# Altium schematic sheet MPPT-BCR.SchDoc
size C
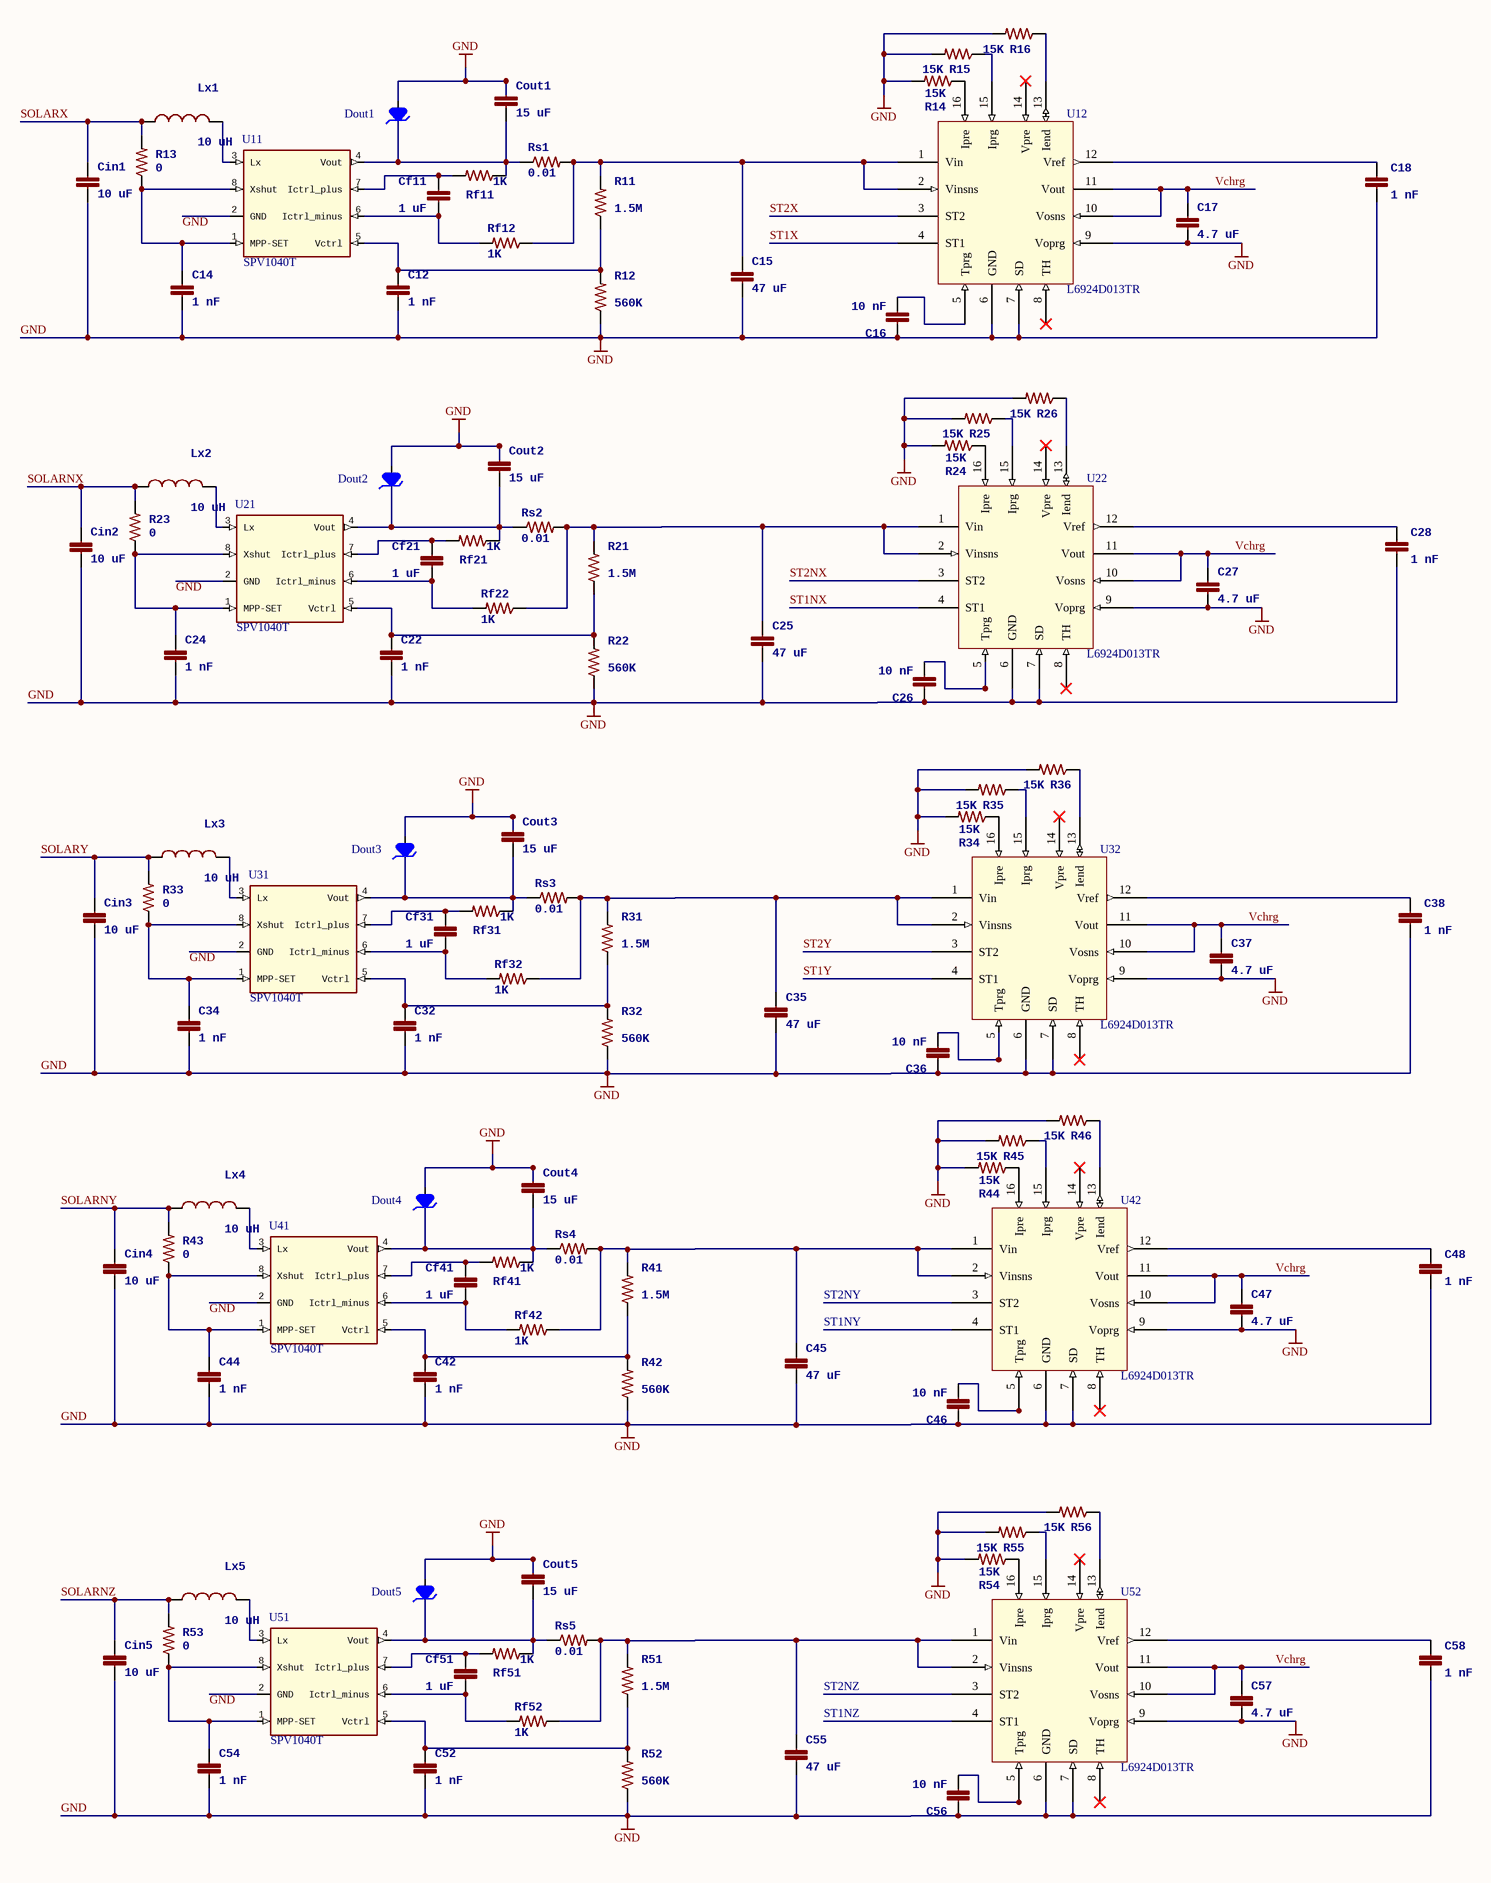
[diagram p0: MPPT-BCR.SchDoc]

## Parts
C12  1 nF  [0805]
C14  1 nF  [0805]
C15  47 uF  [0805]
C16  10 nF  [0805]
C17  4.7 uF  [0805]
C18  1 nF  [0805]
C22  1 nF  [0805]
C24  1 nF  [0805]
C25  47 uF  [0805]
C26  10 nF  [0805]
C27  4.7 uF  [0805]
C28  1 nF  [0805]
C32  1 nF  [0805]
C34  1 nF  [0805]
C35  47 uF  [0805]
C36  10 nF  [0805]
C37  4.7 uF  [0805]
C38  1 nF  [0805]
C42  1 nF  [0805]
C44  1 nF  [0805]
C45  47 uF  [0805]
C46  10 nF  [0805]
C47  4.7 uF  [0805]
C48  1 nF  [0805]
C52  1 nF  [0805]
C54  1 nF  [0805]
C55  47 uF  [0805]
C56  10 nF  [0805]
C57  4.7 uF  [0805]
C58  1 nF  [0805]
Cf11  1 uF  [0805]
Cf21  1 uF  [0805]
Cf31  1 uF  [0805]
Cf41  1 uF  [0805]
Cf51  1 uF  [0805]
Cin1  10 uF  [0805]
Cin2  10 uF  [0805]
Cin3  10 uF  [0805]
Cin4  10 uF  [0805]
Cin5  10 uF  [0805]
Cout1  15 uF  [1210]
Cout2  15 uF  [1210]
Cout3  15 uF  [1210]
Cout4  15 uF  [1210]
Cout5  15 uF  [1210]
Dout1  Diode_Zener  [STmite]  (value not drawn)
Dout2  Diode_Zener  [STmite]  (value not drawn)
Dout3  Diode_Zener  [STmite]  (value not drawn)
Dout4  Diode_Zener  [STmite]  (value not drawn)
Dout5  Diode_Zener  [STmite]  (value not drawn)
Lx1  10 uH  [1007]
Lx2  10 uH  [1007]
Lx3  10 uH  [1007]
Lx4  10 uH  [1007]
Lx5  10 uH  [1007]
R11  1.5M  [0805]
R12  560K  [0805]
R13  0  [0805]
R14  15K  [0805]
R15  15K  [0805]
R16  15K  [0805]
R21  1.5M  [0805]
R22  560K  [0805]
R23  0  [0805]
R24  15K  [0805]
R25  15K  [0805]
R26  15K  [0805]
R31  1.5M  [0805]
R32  560K  [0805]
R33  0  [0805]
R34  15K  [0805]
R35  15K  [0805]
R36  15K  [0805]
R41  1.5M  [0805]
R42  560K  [0805]
R43  0  [0805]
R44  15K  [0805]
R45  15K  [0805]
R46  15K  [0805]
R51  1.5M  [0805]
R52  560K  [0805]
R53  0  [0805]
R54  15K  [0805]
R55  15K  [0805]
R56  15K  [0805]
Rf11  1K  [0805]
Rf12  1K  [0805]
Rf21  1K  [0805]
Rf22  1K  [0805]
Rf31  1K  [0805]
Rf32  1K  [0805]
Rf41  1K  [0805]
Rf42  1K  [0805]
Rf51  1K  [0805]
Rf52  1K  [0805]
Rs1  0.01  [0805]
Rs2  0.01  [0805]
Rs3  0.01  [0805]
Rs4  0.01  [0805]
Rs5  0.01  [0805]
U11  Manufacturer Part Number: SPV1040T  [TSSOP8]  (hidden comment: SPV1040)
U12  L6924D013TR  [VQFN16_AP]
U21  Manufacturer Part Number: SPV1040T  [TSSOP8]  (hidden comment: SPV1040)
U22  L6924D013TR  [VQFN16_AP]
U31  Manufacturer Part Number: SPV1040T  [TSSOP8]  (hidden comment: SPV1040)
U32  L6924D013TR  [VQFN16_AP]
U41  Manufacturer Part Number: SPV1040T  [TSSOP8]  (hidden comment: SPV1040)
U42  L6924D013TR  [VQFN16_AP]
U51  Manufacturer Part Number: SPV1040T  [TSSOP8]  (hidden comment: SPV1040)
U52  L6924D013TR  [VQFN16_AP]

## Nets
GND: C12.2 C14.2 C15.2 C16.1 C17.2 C18.2 C22.2 C24.2 C25.2 C26.1 C27.2 C28.2 C32.2 C34.2 C35.2 C36.1 C37.2 C38.2 C42.2 C44.2 C45.2 C46.1 C47.2 C48.2 C52.2 C54.2 C55.2 C56.1 C57.2 C58.2 Cin1.2 Cin2.2 Cin3.2 Cin4.2 Cin5.2 Cout1.1 Cout2.1 Cout3.1 Cout4.1 Cout5.1 Dout1.2 Dout2.2 Dout3.2 Dout4.2 Dout5.2 R12.1 R14.2 R15.2 R16.2 R22.1 R24.2 R25.2 R26.2 R32.1 R34.2 R35.2 R36.2 R42.1 R44.2 R45.2 R46.2 R52.1 R54.2 R55.2 R56.2 U12.6(GND) U12.7(SD) U12.9(Voprg) U22.6(GND) U22.7(SD) U22.9(Voprg) U32.6(GND) U32.7(SD) U32.9(Voprg) U42.6(GND) U42.7(SD) U42.9(Voprg) U52.6(GND) U52.7(SD) U52.9(Voprg)
SOLARNX: Cin2.1 Lx2.1 R23.2
SOLARNY: Cin4.1 Lx4.1 R43.2
SOLARNZ: Cin5.1 Lx5.1 R53.2
SOLARX: Cin1.1 Lx1.1 R13.2
SOLARY: Cin3.1 Lx3.1 R33.2
ST1NX: U22.4(ST1)
ST1X: U12.4(ST1)
ST1Y: U32.4(ST1)
ST2NX: U22.3(ST2)
ST2X: U12.3(ST2)
ST2Y: U32.3(ST2)
Vchrg: C17.1 C27.1 C37.1 C47.1 C57.1 U12.10(Vosns) U12.11(Vout) U22.10(Vosns) U22.11(Vout) U32.10(Vosns) U32.11(Vout) U42.10(Vosns) U42.11(Vout) U52.10(Vosns) U52.11(Vout)
NetC12_1: C12.1 R11.1 R12.2 U11.5(Vctrl)
NetC14_1: C14.1 R13.1 U11.1(MPP-SET) U11.8(Xshut)
NetC15_1: C15.1 R11.2 Rf12.1 Rs1.2 U12.1(Vin) U12.2(Vinsns)
NetC16_2: C16.2 U12.5(Tprg)
NetC18_1: C18.1 U12.12(Vref)
NetC22_1: C22.1 R21.1 R22.2 U21.5(Vctrl)
NetC24_1: C24.1 R23.1 U21.1(MPP-SET) U21.8(Xshut)
NetC25_1: C25.1 R21.2 Rf22.1 Rs2.2 U22.1(Vin) U22.2(Vinsns)
NetC26_2: C26.2 U22.5(Tprg)
NetC28_1: C28.1 U22.12(Vref)
NetC32_1: C32.1 R31.1 R32.2 U31.5(Vctrl)
NetC34_1: C34.1 R33.1 U31.1(MPP-SET) U31.8(Xshut)
NetC35_1: C35.1 R31.2 Rf32.1 Rs3.2 U32.1(Vin) U32.2(Vinsns)
NetC36_2: C36.2 U32.5(Tprg)
NetC38_1: C38.1 U32.12(Vref)
NetC42_1: C42.1 R41.1 R42.2 U41.5(Vctrl)
NetC44_1: C44.1 R43.1 U41.1(MPP-SET) U41.8(Xshut)
NetC45_1: C45.1 R41.2 Rf42.1 Rs4.2 U42.1(Vin) U42.2(Vinsns)
NetC46_2: C46.2 U42.5(Tprg)
NetC48_1: C48.1 U42.12(Vref)
NetC52_1: C52.1 R51.1 R52.2 U51.5(Vctrl)
NetC54_1: C54.1 R53.1 U51.1(MPP-SET) U51.8(Xshut)
NetC55_1: C55.1 R51.2 Rf52.1 Rs5.2 U52.1(Vin) U52.2(Vinsns)
NetC56_2: C56.2 U52.5(Tprg)
NetC58_1: C58.1 U52.12(Vref)
NetCf11_1: Cf11.1 Rf11.2 U11.7(Ictrl_plus)
NetCf11_2: Cf11.2 Rf12.2 U11.6(Ictrl_minus)
NetCf21_1: Cf21.1 Rf21.2 U21.7(Ictrl_plus)
NetCf21_2: Cf21.2 Rf22.2 U21.6(Ictrl_minus)
NetCf31_1: Cf31.1 Rf31.2 U31.7(Ictrl_plus)
NetCf31_2: Cf31.2 Rf32.2 U31.6(Ictrl_minus)
NetCf41_1: Cf41.1 Rf41.2 U41.7(Ictrl_plus)
NetCf41_2: Cf41.2 Rf42.2 U41.6(Ictrl_minus)
NetCf51_1: Cf51.1 Rf51.2 U51.7(Ictrl_plus)
NetCf51_2: Cf51.2 Rf52.2 U51.6(Ictrl_minus)
NetCout1_2: Cout1.2 Dout1.1 Rf11.1 Rs1.1 U11.4(Vout)
NetCout2_2: Cout2.2 Dout2.1 Rf21.1 Rs2.1 U21.4(Vout)
NetCout3_2: Cout3.2 Dout3.1 Rf31.1 Rs3.1 U31.4(Vout)
NetCout4_2: Cout4.2 Dout4.1 Rf41.1 Rs4.1 U41.4(Vout)
NetCout5_2: Cout5.2 Dout5.1 Rf51.1 Rs5.1 U51.4(Vout)
NetLx1_2: Lx1.2 U11.3(Lx)
NetLx2_2: Lx2.2 U21.3(Lx)
NetLx3_2: Lx3.2 U31.3(Lx)
NetLx4_2: Lx4.2 U41.3(Lx)
NetLx5_2: Lx5.2 U51.3(Lx)
NetR14_1: R14.1 U12.16(Ipre)
NetR15_1: R15.1 U12.15(Iprg)
NetR16_1: R16.1 U12.13(Iend)
NetR24_1: R24.1 U22.16(Ipre)
NetR25_1: R25.1 U22.15(Iprg)
NetR26_1: R26.1 U22.13(Iend)
NetR34_1: R34.1 U32.16(Ipre)
NetR35_1: R35.1 U32.15(Iprg)
NetR36_1: R36.1 U32.13(Iend)
NetR44_1: R44.1 U42.16(Ipre)
NetR45_1: R45.1 U42.15(Iprg)
NetR46_1: R46.1 U42.13(Iend)
NetR54_1: R54.1 U52.16(Ipre)
NetR55_1: R55.1 U52.15(Iprg)
NetR56_1: R56.1 U52.13(Iend)

Not connected (* = marked no-connect by the designer): U11 2(GND); U12 8(TH)* 14(Vpre)*; U21 2(GND); U22 8(TH)* 14(Vpre)*; U31 2(GND); U32 8(TH)* 14(Vpre)*; U41 2(GND); U42 3(ST2) 4(ST1) 8(TH)* 14(Vpre)*; U51 2(GND); U52 3(ST2) 4(ST1) 8(TH)* 14(Vpre)*

## Notes on the sheet
- ST2NY
- (near C45) ST1NY
- ST2NZ
- (near C55) ST1NZ
- Labels drawn without touching a wire or pin: GND

## Library data of the parts
C12 C14 C18 C22 C24 C28 C32 C34 C38 C42 C44 C48 C52 C54 C58 = CAP0805_1nF: Tolerance: ±10%; Voltage - Rated: 10V; Temperature Coefficient: X7R; RoHS: RoHS Compliant; Category: Capacitors; Packaging: Tape & Reel (TR); Mounting Type: Surface Mount, MLCC; Operating Temperature: -55°C ~ 125°C; Applications: General Purpose; Ratings: -; Package / Case: 0805 (2012 Metric); Size / Dimension: 0.079" L x 0.049" W (2.00mm x 1.25mm); Height - Seated (Max): -; Thickness (Max): 0.039" (1.00mm); Lead Spacing: -; Features: -; Lead Style: -; ComponentLink1URL: http://www.kemet.com/docfinder?Partnumber=C0805C105K8RACTU; ComponentLink1Description: http://www.kemet.com/docfinder?Partnumber=C0805C105K8RACTU; Value: 1 nF; Supplier 1: Digi-Key; Supplier Part Number 1: 445-1330-1-ND
C15 C25 C35 C45 C55 = CAP0805_47000nF: Tolerance: ±10%; Voltage - Rated: 10V; Temperature Coefficient: X5R; RoHS: RoHS Compliant; Category: Capacitors; Packaging: Tape & Reel (TR); Mounting Type: Surface Mount, MLCC; Operating Temperature: -55°C ~ 125°C; Applications: General Purpose; Ratings: -; Package / Case: 0805 (2012 Metric); Size / Dimension: 0.079" L x 0.049" W (2.00mm x 1.25mm); Thickness (Max): 0.039" (1.00mm); Value: 47 uF; Supplier 1: Digi-Key; Supplier Part Number 1: 399-5506-1-ND
C16 C26 C36 C46 C56 = CAP0805_10nF: Tolerance: ±10%; Voltage - Rated: 10V; Temperature Coefficient: X7R; RoHS: RoHS Compliant; Category: Capacitors; Packaging: Tape & Reel (TR); Mounting Type: Surface Mount, MLCC; Operating Temperature: -55°C ~ 125°C; Applications: General Purpose; Ratings: -; Package / Case: 0805 (2012 Metric); Size / Dimension: 0.079" L x 0.049" W (2.00mm x 1.25mm); Height - Seated (Max): -; Thickness (Max): 0.039" (1.00mm); Lead Spacing: -; Features: -; Lead Style: -; ComponentLink1URL: http://www.kemet.com/docfinder?Partnumber=C0805C105K8RACTU; ComponentLink1Description: http://www.kemet.com/docfinder?Partnumber=C0805C105K8RACTU; Value: 10 nF; Supplier 1: Digi-Key; Supplier Part Number 1: 1276-2437-1-ND
C17 C27 C37 C47 C57 = CAP0805_4700nF: Tolerance: ±10%; Voltage - Rated: 10V; Temperature Coefficient: X5R; RoHS: RoHS Compliant; Category: Capacitors; Packaging: Tape & Reel (TR); Mounting Type: Surface Mount, MLCC; Operating Temperature: -55°C ~ 125°C; Applications: General Purpose; Ratings: -; Package / Case: 0805 (2012 Metric); Size / Dimension: 0.079" L x 0.049" W (2.00mm x 1.25mm); Thickness (Max): 0.039" (1.00mm); Value: 4.7 uF; Supplier 1: Digi-Key; Supplier Part Number 1: 709-1230-1-ND
Cf11 Cf21 Cf31 Cf41 Cf51 = CAP0805_1uF: Manufacturer: Kemet; Manufacturer Part Number: C0805C105K8RACTU; Tolerance: ±10%; Voltage - Rated: 10V; Temperature Coefficient: X7R; RoHS: RoHS Compliant; Category: Capacitors; Packaging: Tape & Reel (TR); Mounting Type: Surface Mount, MLCC; Operating Temperature: -55°C ~ 125°C; Applications: General Purpose; Ratings: -; Package / Case: 0805 (2012 Metric); Size / Dimension: 0.079" L x 0.049" W (2.00mm x 1.25mm); Height - Seated (Max): -; Thickness (Max): 0.039" (1.00mm); Lead Spacing: -; Features: -; Lead Style: -; ComponentLink1URL: http://www.kemet.com/docfinder?Partnumber=C0805C105K8RACTU; ComponentLink1Description: http://www.kemet.com/docfinder?Partnumber=C0805C105K8RACTU; Value: 1 uF; Supplier 1: Digi-Key; Supplier Part Number 1: 445-1358-1-ND
Cin1-Cin5 = CAP0805_10uF: Tolerance: ±10%; Voltage - Rated: 10V; Temperature Coefficient: X5R; RoHS: RoHS Compliant; Category: Capacitors; Packaging: Tape & Reel (TR); Mounting Type: Surface Mount, MLCC; Operating Temperature: -55°C ~ 125°C; Applications: General Purpose; Ratings: -; Package / Case: 0805 (2012 Metric); Size / Dimension: 0.079" L x 0.049" W (2.00mm x 1.25mm); Thickness (Max): 0.039" (1.00mm); Supplier 1: Digi-Key; Supplier Part Number 1: 445-7660-1-ND; Value: 10 uF
Cout1-Cout5 = CAP0805_15uF: Tolerance: ±10%; Voltage - Rated: 10V; Temperature Coefficient: X5R; RoHS: RoHS Compliant; Category: Capacitors; Packaging: Tape & Reel (TR); Mounting Type: Surface Mount, MLCC; Operating Temperature: -55°C ~ 125°C; Applications: General Purpose; Ratings: -; Package / Case: 0805 (2012 Metric); Size / Dimension: 0.079" L x 0.049" W (2.00mm x 1.25mm); Thickness (Max): 0.039" (1.00mm); Value: 15 uF; Supplier 1: Digi-Key; Supplier Part Number 1: 445-3950-2-ND
Dout1-Dout5 = Diode_Zener: Voltage - Zener (Nom) (Vz): 3.3V; Tolerance: ±5%; Power - Max: 3W; Impedance (Max) (Zzt): 10 Ohm; Current - Reverse Leakage @ Vr: 100µA @ 1V; Voltage - Forward (Vf) (Max) @ If: 1.5V @ 200mA; Supplier 1: Digi-Key; RoHS: RoHS Compliant; Category: Discrete Semiconductor Products; Packaging: Cut Tape (CT); Operating Temperature: -65°C ~ 150°C; Mounting Type: Surface Mount; Package / Case: DO-220AA; Supplier Device Package: SMB; ComponentLink1URL: http://www.onsemi.com/pub_link/Collateral/1SMB5913BT3-D.PDF; ComponentLink1Description: http://www.onsemi.com/pub_link/Collateral/1SMB5913BT3-D.PDF; Supplier Part Number 1: 497-15660-1-ND
Lx1-Lx5 = INDUCTOR1007: Supplier 1: Digi-Key; Supplier Part Number 1: 587-1613-1-ND
R11 R21 R31 R41 R51 = RES_0805_1500K: Manufacturer: TE Connectivity; Manufacturer Part Number: 1625856-2; Tolerance: ±10%; Power (Watts): 0.125W, 1/8W; Temperature Coefficient: ±100ppm/°C; Supplier 1: Digi-Key; RoHS: RoHS Compliant; Category: Resistors; Packaging: Cut Tape (CT); Resistance (Ohms): 1.5M; Composition: Thick Film; Features: -; Operating Temperature: -55°C ~ 125°C; Package / Case: 0805 (2012 Metric); Supplier Device Package: 0805; Size / Dimension: 0.079" L x 0.047" W (2.00mm x 1.20mm); Height: 0.020" (0.50mm); Number of Terminations: 2; ComponentLink1URL: http://www.te.com/commerce/DocumentDelivery/DDEController?Action=srchrtrv&DocNm=1625856&DocType=Customer+Drawing&DocLang=English; ComponentLink1Description: http://www.te.com/commerce/DocumentDelivery/DDEController?Action=srchrtrv&DocNm=1625856&DocType=Customer+Drawing&DocLang=English; Supplier Part Number 1: A103799CT-ND; Value: 1.5M
R12 R22 R32 R42 R52 = RES_0805_560K: Manufacturer: TE Connectivity; Manufacturer Part Number: 1625856-2; Tolerance: ±10%; Power (Watts): 0.125W, 1/8W; Temperature Coefficient: ±100ppm/°C; Supplier 1: Digi-Key; RoHS: RoHS Compliant; Category: Resistors; Packaging: Cut Tape (CT); Resistance (Ohms): 560K; Composition: Thick Film; Features: -; Operating Temperature: -55°C ~ 125°C; Package / Case: 0805 (2012 Metric); Supplier Device Package: 0805; Size / Dimension: 0.079" L x 0.047" W (2.00mm x 1.20mm); Height: 0.020" (0.50mm); Number of Terminations: 2; ComponentLink1URL: http://www.te.com/commerce/DocumentDelivery/DDEController?Action=srchrtrv&DocNm=1625856&DocType=Customer+Drawing&DocLang=English; ComponentLink1Description: http://www.te.com/commerce/DocumentDelivery/DDEController?Action=srchrtrv&DocNm=1625856&DocType=Customer+Drawing&DocLang=English; Supplier Part Number 1: A103220CT-ND; Value: 560K
R13 R23 R33 R43 R53 = RES_0805_0: Manufacturer: TE Connectivity; Manufacturer Part Number: 1625856-2; Resistance (Ohms): 100M; Tolerance: ±10%; Power (Watts): 0.125W, 1/8W; Temperature Coefficient: ±100ppm/°C; Supplier 1: Digi-Key; RoHS: RoHS Compliant; Category: Resistors; Packaging: Cut Tape (CT); Composition: Thick Film; Features: -; Operating Temperature: -55°C ~ 125°C; Package / Case: 0805 (2012 Metric); Supplier Device Package: 0805; Size / Dimension: 0.079" L x 0.047" W (2.00mm x 1.20mm); Height: 0.020" (0.50mm); Number of Terminations: 2; ComponentLink1URL: http://www.te.com/commerce/DocumentDelivery/DDEController?Action=srchrtrv&DocNm=1625856&DocType=Customer+Drawing&DocLang=English; ComponentLink1Description: http://www.te.com/commerce/DocumentDelivery/DDEController?Action=srchrtrv&DocNm=1625856&DocType=Customer+Drawing&DocLang=English; Supplier Part Number 1: RHM0.0ARCT-ND; Value: 0
R14-R16 R24-R26 R34-R36 R44-R46 R54-R56 = RES_0805_15K: Manufacturer: TE Connectivity; Manufacturer Part Number: 1625856-2; Tolerance: ±10%; Power (Watts): 0.125W, 1/8W; Temperature Coefficient: ±100ppm/°C; RoHS: RoHS Compliant; Category: Resistors; Packaging: Cut Tape (CT); Resistance (Ohms): 15K; Composition: Thick Film; Features: -; Operating Temperature: -55°C ~ 125°C; Package / Case: 0805 (2012 Metric); Supplier Device Package: 0805; Size / Dimension: 0.079" L x 0.047" W (2.00mm x 1.20mm); Height: 0.020" (0.50mm); Number of Terminations: 2; ComponentLink1URL: http://www.te.com/commerce/DocumentDelivery/DDEController?Action=srchrtrv&DocNm=1625856&DocType=Customer+Drawing&DocLang=English; ComponentLink1Description: http://www.te.com/commerce/DocumentDelivery/DDEController?Action=srchrtrv&DocNm=1625856&DocType=Customer+Drawing&DocLang=English; Value: 15K; Supplier 1: Digi-Key; Supplier Part Number 1: 311-15.0KCRCT-ND
Rf11 Rf12 Rf21 Rf22 Rf31 Rf32 Rf41 Rf42 Rf51 Rf52 = RES_0805_1K: Manufacturer: TE Connectivity; Manufacturer Part Number: 1625856-2; Resistance (Ohms): 100M; Tolerance: ±10%; Power (Watts): 0.125W, 1/8W; Temperature Coefficient: ±100ppm/°C; Supplier 1: Digi-Key; RoHS: RoHS Compliant; Category: Resistors; Packaging: Cut Tape (CT); Composition: Thick Film; Features: -; Operating Temperature: -55°C ~ 125°C; Package / Case: 0805 (2012 Metric); Supplier Device Package: 0805; Size / Dimension: 0.079" L x 0.047" W (2.00mm x 1.20mm); Height: 0.020" (0.50mm); Number of Terminations: 2; ComponentLink1URL: http://www.te.com/commerce/DocumentDelivery/DDEController?Action=srchrtrv&DocNm=1625856&DocType=Customer+Drawing&DocLang=English; ComponentLink1Description: http://www.te.com/commerce/DocumentDelivery/DDEController?Action=srchrtrv&DocNm=1625856&DocType=Customer+Drawing&DocLang=English; Supplier Part Number 1: P1.00KCCT-ND; Value: 1K
Rs1-Rs5 = RES_0805_01: Manufacturer: TE Connectivity; Manufacturer Part Number: 1625856-2; Resistance (Ohms): 100M; Tolerance: ±10%; Power (Watts): 0.125W, 1/8W; Temperature Coefficient: ±100ppm/°C; Supplier 1: Digi-Key; RoHS: RoHS Compliant; Category: Resistors; Packaging: Cut Tape (CT); Composition: Thick Film; Features: -; Operating Temperature: -55°C ~ 125°C; Package / Case: 0805 (2012 Metric); Supplier Device Package: 0805; Size / Dimension: 0.079" L x 0.047" W (2.00mm x 1.20mm); Height: 0.020" (0.50mm); Number of Terminations: 2; ComponentLink1URL: http://www.te.com/commerce/DocumentDelivery/DDEController?Action=srchrtrv&DocNm=1625856&DocType=Customer+Drawing&DocLang=English; ComponentLink1Description: http://www.te.com/commerce/DocumentDelivery/DDEController?Action=srchrtrv&DocNm=1625856&DocType=Customer+Drawing&DocLang=English; Supplier Part Number 1: RL12T.010JCT-ND; Value: 0.01
U11 U21 U31 U41 U51 = SPV1040: Manufacturer: STMicroelectronics; Function: Charge Management, Solar; Voltage - Supply: 0.3 V ~ 5.5 V; Supplier 1: Digi-Key; RoHS: RoHS Compliant; Category: Integrated Circuits (ICs); Stock 1: 10; Pricing 1: 1=5.14, 10=4.584 (CAD); Packaging: Tube; Battery Chemistry: -; Operating Temperature: -40°C ~ 85°C; Mounting Type: Surface Mount; Package / Case: 8-TSSOP (0.173", 4.40mm Width); Supplier Device Package: 8-TSSOP; ComponentLink1URL: http://www.st.com/web/en/resource/technical/document/datasheet/CD00287506.pdf; ComponentLink1Description: http://www.st.com/web/en/resource/technical/document/datasheet/CD00287506.pdf; Supplier Part Number 1: 497-11417-ND
U12 U22 U32 U42 U52 = L6924D013TR: IC BATT CHRGR ION/POLY 16-VFQFPN; Manufacturer: STMicroelectronics; Function: Charge Management; Battery Chemistry: Li-Ion, Li-Pol; Voltage - Supply: 2.5 V ~ 12 V; Supplier 1: Digi-Key; Manufacturer Part Number: L6924D013TR; RoHS: RoHS Compliant; Category: Integrated Circuits (ICs); Stock 1: 3342; Pricing 1: 1=2.74, 10=2.477, 25=2.2188, 100=1.9951, 250=1.77148, 500=1.54788, 1000=1.2813 (CAD); Packaging: Cut Tape (CT); Operating Temperature: -40°C ~ 125°C; Mounting Type: Surface Mount; Package / Case: 16-VFQFN; Supplier Device Package: 16-VFQFP-N (3x3); ComponentLink1URL: http://www.st.com/web/en/resource/technical/document/datasheet/CD00079821.pdf; ComponentLink1Description: http://www.st.com/web/en/resource/technical/document/datasheet/CD00079821.pdf; Supplier Part Number 1: 497-5100-1-ND